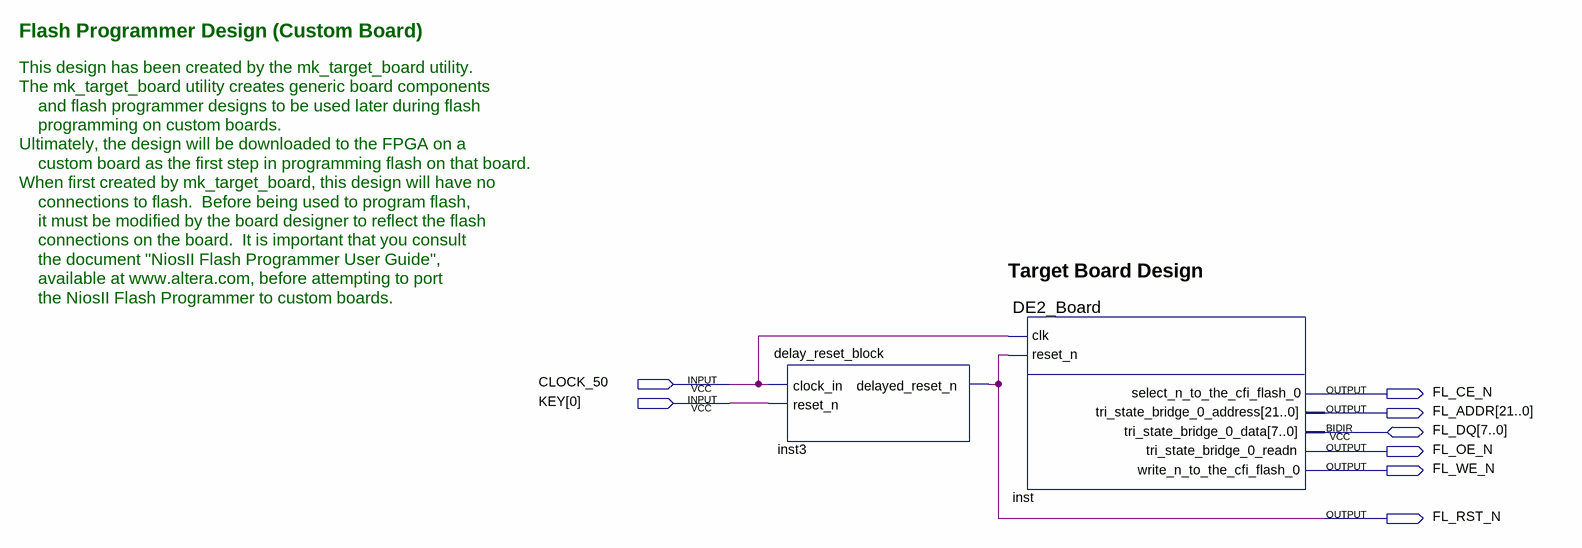
[diagram p0: schematic sheet]
// Quartus schematic DE2_Board_top.bdf as structural Verilog: 2 symbols, 8 pins
module DE2_Board_top (
  input  CLOCK_50,
  input  [0:0] KEY,
  inout  [7:0] FL_DQ,
  output FL_CE_N,
  output [21:0] FL_ADDR,
  output FL_OE_N,
  output FL_WE_N,
  output FL_RST_N
);

  delay_reset_block inst3 (.clock_in(CLOCK_50), .reset_n(KEY[0]), .delayed_reset_n(FL_RST_N));
  DE2_Board inst (
    .clk(CLOCK_50), .reset_n(FL_RST_N), .select_n_to_the_cfi_flash_0(FL_CE_N),
    .tri_state_bridge_0_address(FL_ADDR), .tri_state_bridge_0_readn(FL_OE_N),
    .write_n_to_the_cfi_flash_0(FL_WE_N), .tri_state_bridge_0_data(FL_DQ));

  // Notes on the sheet:
  //   Flash Programmer Design (Custom Board)
  //   This design has been created by the mk_target_board utility.
  //   The mk_target_board utility creates generic board components
  //   and flash programmer designs to be used later during flash
  //   programming on custom boards.
  //   Ultimately, the design will be downloaded to the FPGA on a
  //   custom board as the first step in programming flash on that board.
  //   When first created by mk_target_board, this design will have no
  //   connections to flash.  Before being used to program flash,
  //   it must be modified by the board designer to reflect the flash
  //   connections on the board.  It is important that you consult
  //   the document "NiosII Flash Programmer User Guide",
  //   Target Board Design
  //   available at www.altera.com, before attempting to port
  //   the NiosII Flash Programmer to custom boards.
endmodule
